# EAGLE design XuLA-LA (EAGLE 5.11)
AUTHOR: Dave Vandenbout / XESS Corp.; DIGIKEY#: 296-16843-1-ND; MANF: TDK; MANF#: C1608X7R1C105KT; MOUSER#: 810-C1608X7R1C105K; VERSION#: 1.0
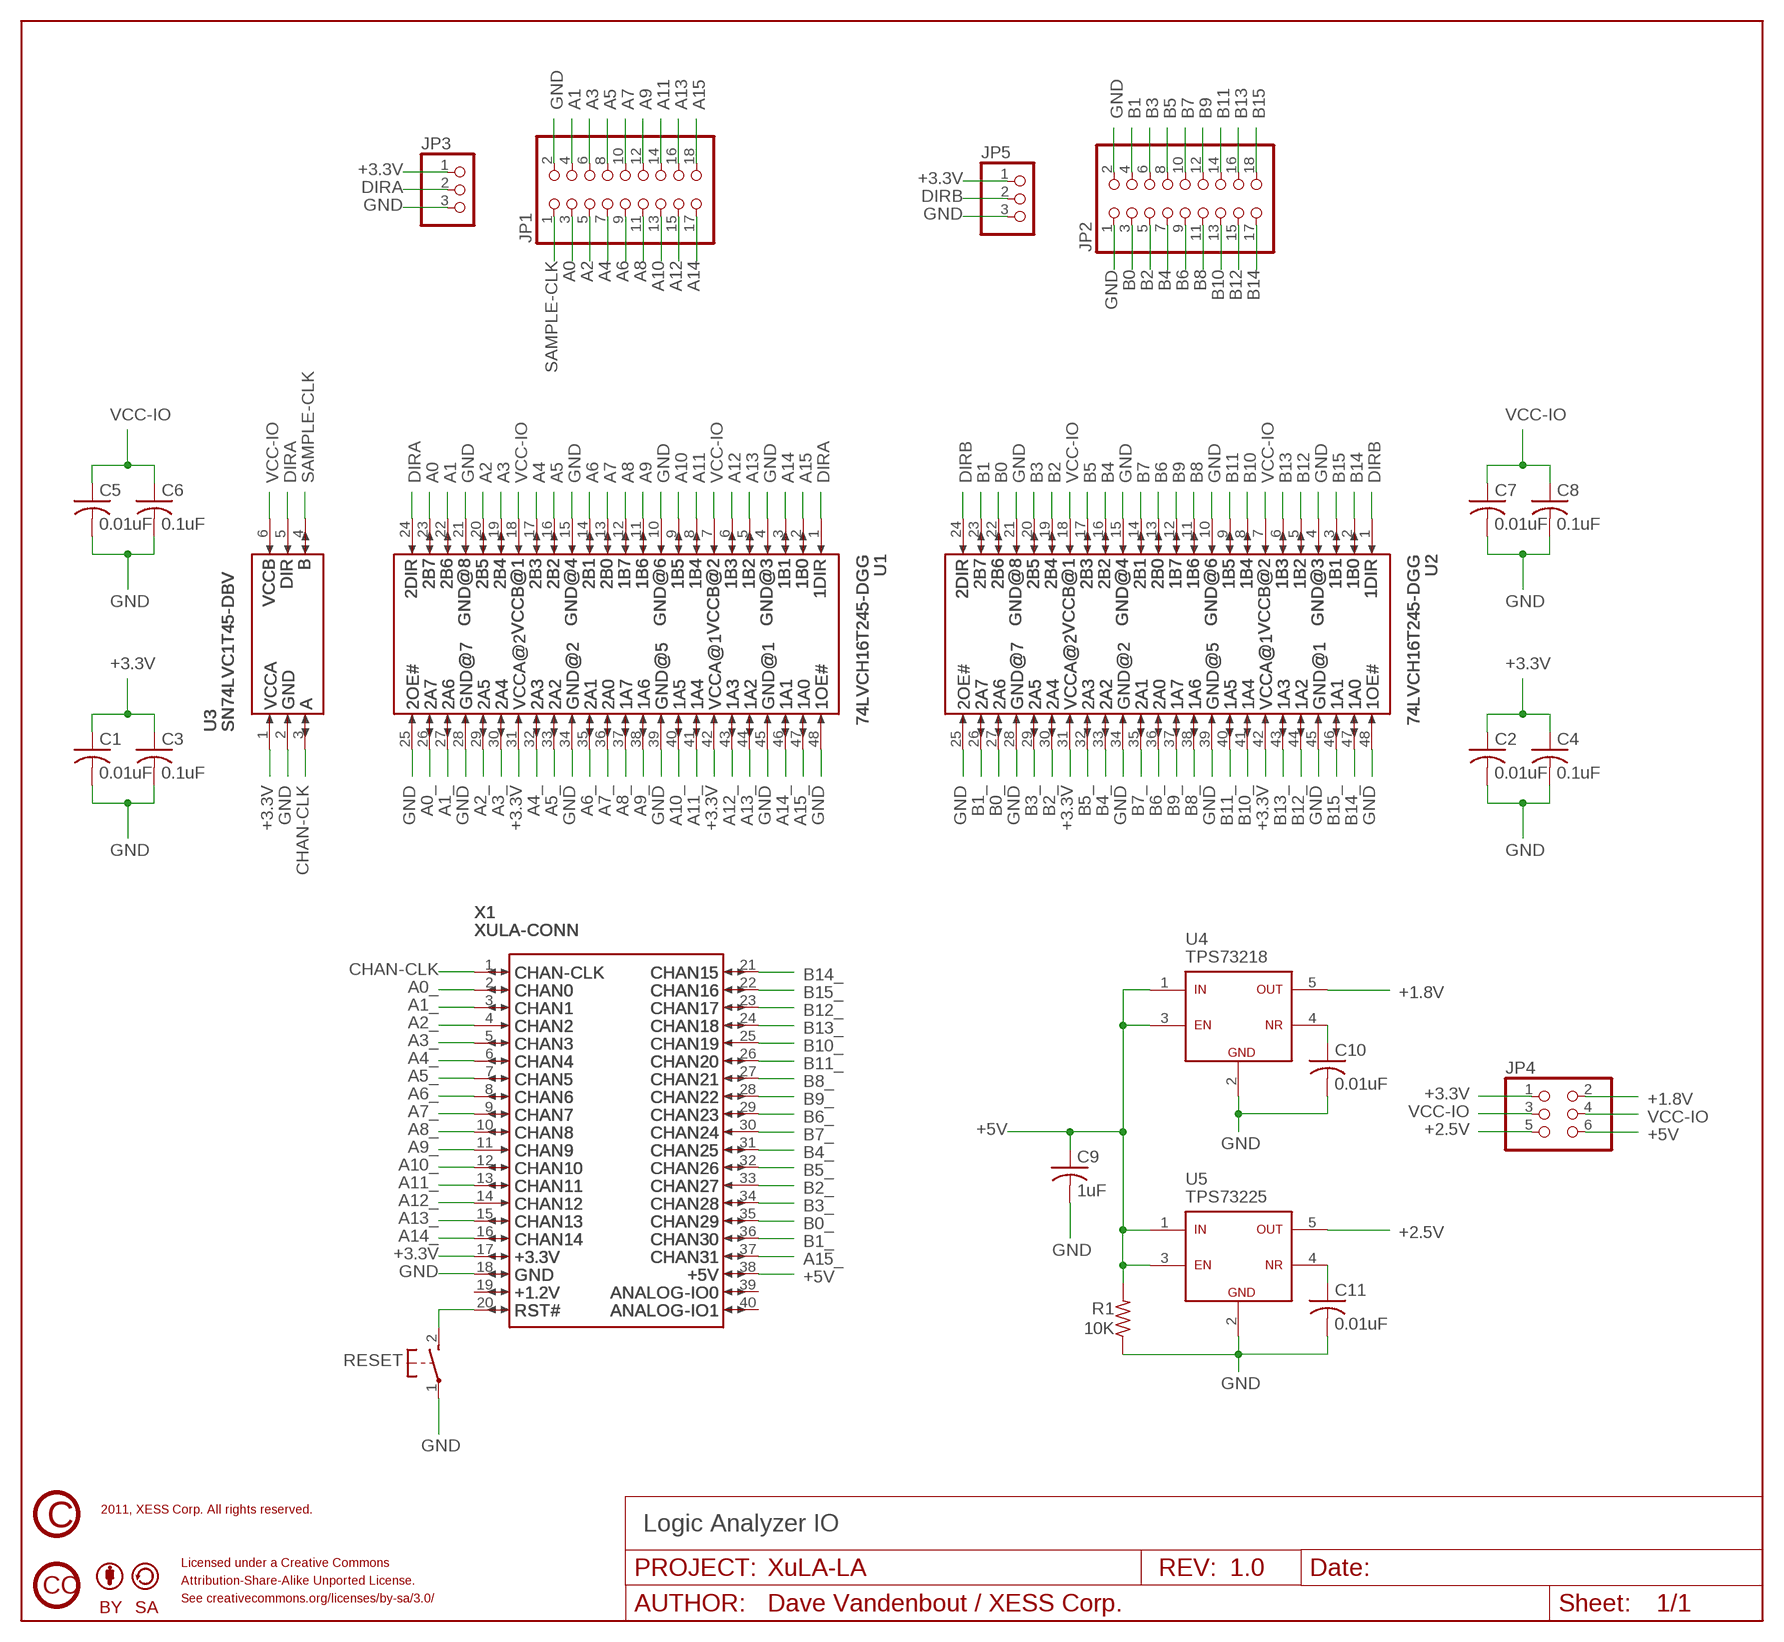
[diagram p0: schematic, sheet 1]

## Parts
C1  0.01uF  C-USC0402  [C0402]
C2  0.01uF  C-USC0402  [C0402]
C3  0.1uF  C-USC0603  [C0603]
C4  0.1uF  C-USC0603  [C0603]
C5  0.01uF  C-USC0402  [C0402]
C6  0.1uF  C-USC0603  [C0603]
C7  0.01uF  C-USC0402  [C0402]
C8  0.1uF  C-USC0603  [C0603]
C9  1uF  C-USC0603  [C0603]
C10  0.01uF  C-USC0603  [C0603]
C11  0.01uF  C-USC0603  [C0603]
JP1  PINHD-2X9  [2X09]
JP2  PINHD-2X9  [2X09]
JP3  PINHD-1X3  [1X03]
JP4  PINHD-2X3  [2X03]
JP5  PINHD-1X3  [1X03]
R1  10K  R-US_R0805  [R0805]
RESET  MINI_TACT_SW  [TL3310AF120QG]
U1  74LVCH16T245-DGG  [TI-TSSOP48]
U2  74LVCH16T245-DGG  [TI-TSSOP48]
U3  SN74LVC1T45-DBV  [TI-R-PDSO-G6-DBV]
U4  TPS73218  TPS732XX  [SOP5]
U5  TPS73225  TPS732XX  [SOP5]
U$2  CC_CC  [CC_CC]
U$3  CC_BY  [CC_BY]
U$4  CC_SA  [CC_SA]
U$5  CC_COPYRIGHT  [CC_COPYRIGHT]
X1  XULA-CONN  [XULA-DIP40]

## Nets
+1.8V: JP4.2 U4.5
+2.5V: JP4.5 U5.5
+3.3V: C1.1 C2.1 C3.1 C4.1 JP3.1 JP4.1 JP5.1 U1.31 U1.42 U2.31 U2.42 U3.1 X1.17
+5V: C9.1 JP4.6 R1.2 U4.1 U4.3 U5.1 U5.3 X1.38
A0: JP1.3 U1.23
A0_: U1.26 X1.2
A1: JP1.4 U1.22
A1_: U1.27 X1.3
A2: JP1.5 U1.20
A2_: U1.29 X1.4
A3: JP1.6 U1.19
A3_: U1.30 X1.5
A4: JP1.7 U1.17
A4_: U1.32 X1.6
A5: JP1.8 U1.16
A5_: U1.33 X1.7
A6: JP1.9 U1.14
A6_: U1.35 X1.8
A7: JP1.10 U1.13
A7_: U1.36 X1.9
A8: JP1.11 U1.12
A8_: U1.37 X1.10
A9: JP1.12 U1.11
A9_: U1.38 X1.11
A10: JP1.13 U1.9
A10_: U1.40 X1.12
A11: JP1.14 U1.8
A11_: U1.41 X1.13
A12: JP1.15 U1.6
A12_: U1.43 X1.14
A13: JP1.16 U1.5
A13_: U1.44 X1.15
A14: JP1.17 U1.3
A14_: U1.46 X1.16
A15: JP1.18 U1.2
A15_: U1.47 X1.37
B0: JP2.3 U2.22
B0_: U2.27 X1.35
B1: JP2.4 U2.23
B1_: U2.26 X1.36
B2: JP2.5 U2.19
B2_: U2.30 X1.33
B3: JP2.6 U2.20
B3_: U2.29 X1.34
B4: JP2.7 U2.16
B4_: U2.33 X1.31
B5: JP2.8 U2.17
B5_: U2.32 X1.32
B6: JP2.9 U2.13
B6_: U2.36 X1.29
B7: JP2.10 U2.14
B7_: U2.35 X1.30
B8: JP2.11 U2.11
B8_: U2.38 X1.27
B9: JP2.12 U2.12
B9_: U2.37 X1.28
B10: JP2.13 U2.8
B10_: U2.41 X1.25
B11: JP2.14 U2.9
B11_: U2.40 X1.26
B12: JP2.15 U2.5
B12_: U2.44 X1.23
B13: JP2.16 U2.6
B13_: U2.43 X1.24
B14: JP2.17 U2.2
B14_: U2.47 X1.21
B15: JP2.18 U2.3
B15_: U2.46 X1.22
CHAN-CLK: U3.3 X1.1
DIRA: JP3.2 U1.1 U1.24 U3.5
DIRB: JP5.2 U2.1 U2.24
GND: C1.2 C2.2 C3.2 C4.2 C5.2 C6.2 C7.2 C8.2 C9.2 C10.2 C11.2 JP1.2 JP2.1 JP2.2 JP3.3 JP5.3 R1.1 RESET.1(P) U1.4 U1.10 U1.15 U1.21 U1.25 U1.28 U1.34 U1.39 U1.45 U1.48 U2.4 U2.10 U2.15 U2.21 U2.25 U2.28 U2.34 U2.39 U2.45 U2.48 U3.2 U4.2 U5.2 X1.18
N$1: C10.1 U4.4
N$2: RESET.2(S) X1.20
N$4: C11.1 U5.4
SAMPLE-CLK: JP1.1 U3.4
VCC-IO: C5.1 C6.1 C7.1 C8.1 JP4.3 JP4.4 U1.7 U1.18 U2.7 U2.18 U3.6
Unconnected: X1.19 X1.39 X1.40

## Notes on the sheet
- 2011, XESS Corp. All rights reserved.
- Logic Analyzer IO
- Licensed under a Creative Commons
- Attribution-Share-Alike Unported License.
- See creativecommons.org/licenses/by-sa/3.0/

## Library data of the parts
C1-C11 = rcl:C-US: CAPACITOR, American symbol
JP1 JP2 = pinhead:PINHD-2X9: PIN HEADER
JP3 JP5 = pinhead:PINHD-1X3: PIN HEADER
JP4 = pinhead:PINHD-2X3: PIN HEADER
R1 = rcl:R-US_: RESISTOR, American symbol
RESET = xess:MINI_TACT_SW: Small SMD Tact Switch
U1 U2 = xess:74LVCH16T245: 16-Bit Dual-Supply Bus Transceiver with Configurable Voltage Translation and 3-State Outputs
U3 = xess:SN74LVC1T45: TI Single-Bit Dual-Supply Bus Transceiver with Configurable Voltage Translation and 3-State Outputs
U4 U5 = xess:TPS732XX: Linear Voltage Regulator
U$2 = xess:CC_CC
U$3 = xess:CC_BY
U$4 = xess:CC_SA
U$5 = xess:CC_COPYRIGHT
X1 = xess:XULA-CONN: XuLA Board Connector

## Net classes
1 power: clearance 0.254 mm

## Board
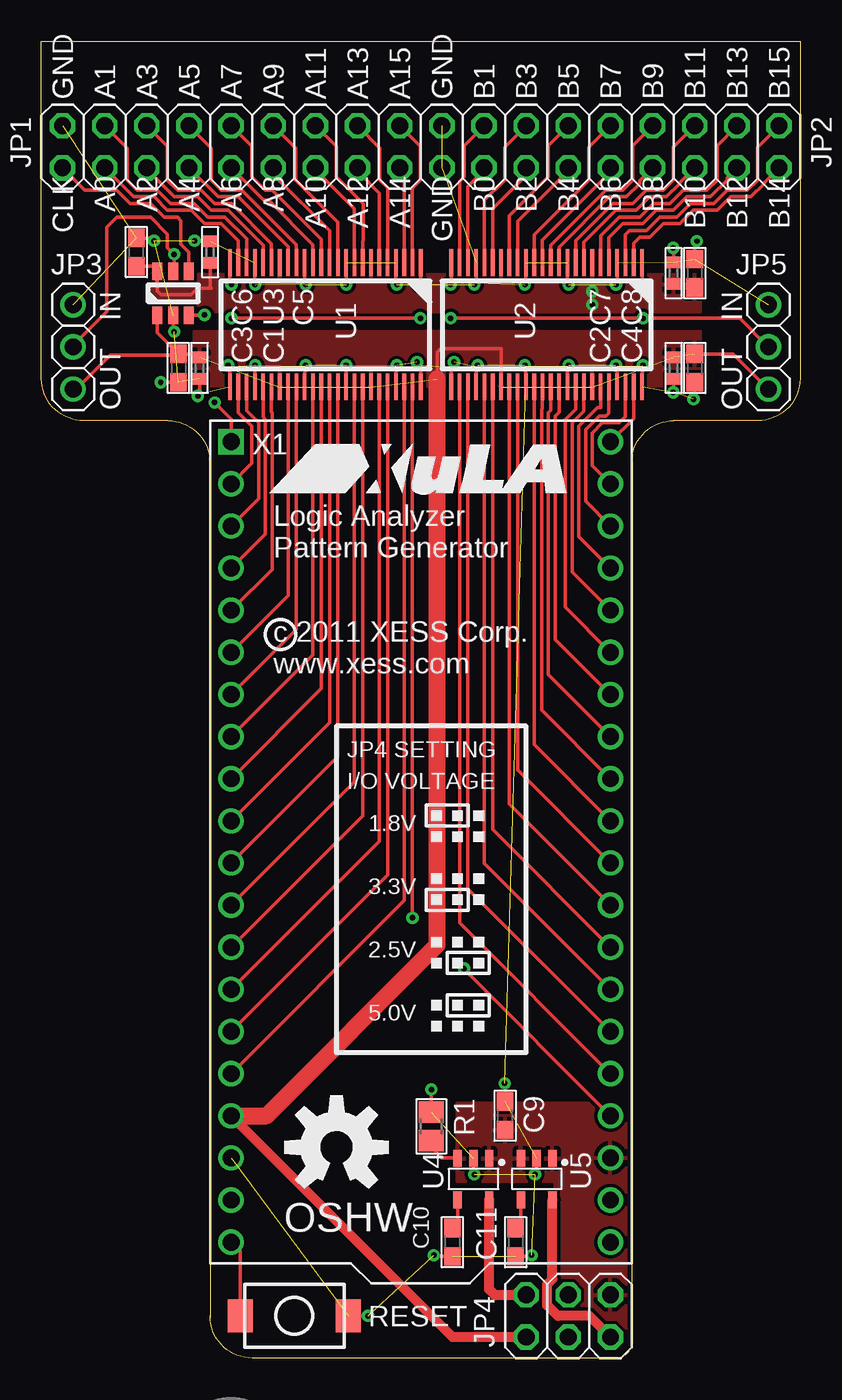
[diagram p1: board, top side]
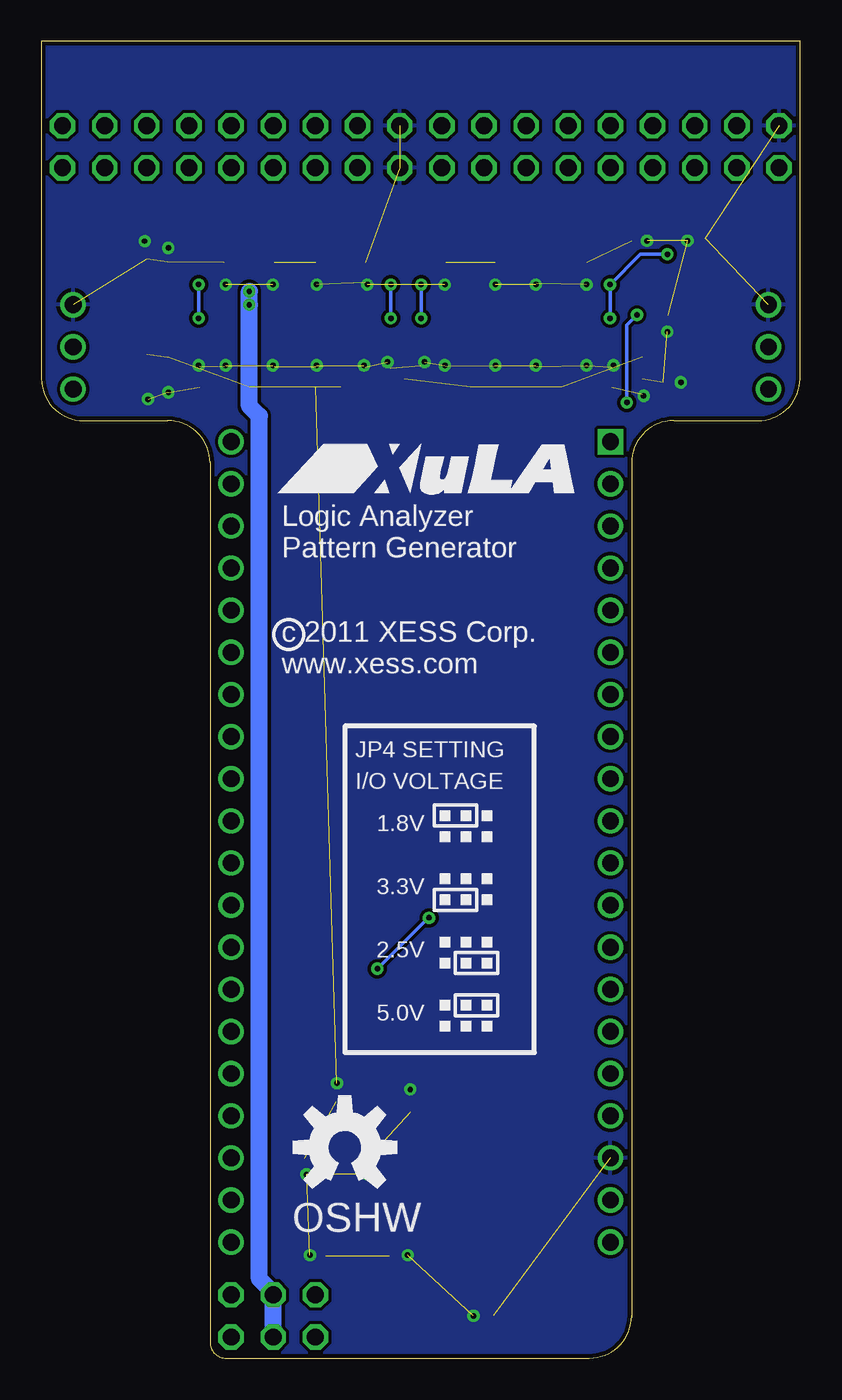
[diagram p2: board, bottom side, seen from below]

Size 45.72 x 79.38 mm. Coordinates in mm from the lower left corner, seen from the top.
Outline: 10.16,2.54 10.16,53.98 arc90 7.62,56.52 2.54,56.52 arc-90 0,59.05 0,79.38 45.72,79.38 45.72,59.05 arc-90 43.18,56.52 38.1,56.52 arc90 35.56,53.98 35.56,1.02 arc-90 34.67,0 12.7,0 arc-90 10.16,2.54
Outline: 10.16,2.54 10.16,2.44
Copper layers (1*16): Top 0.035mm / dielectric 1.5mm / Bottom 0.035mm
Design rules "ITeadstudio_safe": minimum track width 8mil, minimum drill 12mil, track to track 8mil, track to pad 8mil, pad to pad 8mil, via to via 8mil, smd to smd 0mil, copper to edge 10mil, drill to drill 10mil, minimum pad ring 10mil, minimum via ring 8mil, stop-mask expansion 2mil, vias tented up to drill 100mil, thermal gap 10mil

### Footprints (pad centres in the part's own frame; a part is rotated, then mirrored left to right if it is on the bottom)
C0402 = smd 0.7 x 0.9: 1 -0.65,0; 2 0.65,0
C0603 = smd 1.1 x 1: 1 -0.85,0; 2 0.85,0
2X09 = drill 1.016 octagon: 1 -10.16,-1.27; 2 -10.16,1.27; 3 -7.62,-1.27; 4 -7.62,1.27; 5 -5.08,-1.27; 6 -5.08,1.27; 7 -2.54,-1.27; 8 -2.54,1.27; 9 0,-1.27; 10 0,1.27; 11 2.54,-1.27; 12 2.54,1.27; 13 5.08,-1.27; 14 5.08,1.27; 15 7.62,-1.27; 16 7.62,1.27; 17 10.16,-1.27; 18 10.16,1.27
1X03 = drill 1.016 round: 1 -2.54,0; 2 0,0; 3 2.54,0
2X03 = drill 1.016 octagon: 1 -2.54,-1.27; 2 -2.54,1.27; 3 0,-1.27; 4 0,1.27; 5 2.54,-1.27; 6 2.54,1.27
R0805 = smd 1.3 x 1.5: 1 -0.85,0; 2 0.85,0
TL3310AF120QG = smd 1.5 x 2: 1 -3.25,0; 2 3.25,0
TI-TSSOP48 = smd 1.6 x 0.22: 1 0,0; 2 0,-0.5; 3 0,-1; 4 0,-1.5; 5 0,-2; 6 0,-2.5; 7 0,-3; 8 0,-3.5; 9 0,-4; 10 0,-4.5; 11 0,-5; 12 0,-5.5; 13 0,-6; 14 0,-6.5; 15 0,-7; 16 0,-7.5; 17 0,-8; 18 0,-8.5; 19 0,-9; 20 0,-9.5; 21 0,-10; 22 0,-10.5; 23 0,-11; 24 0,-11.5; 25 7.5,-11.5; 26 7.5,-11; 27 7.5,-10.5; 28 7.5,-10; 29 7.5,-9.5; 30 7.5,-9; 31 7.5,-8.5; 32 7.5,-8; 33 7.5,-7.5; 34 7.5,-7; 35 7.5,-6.5; 36 7.5,-6; 37 7.5,-5.5; 38 7.5,-5; 39 7.5,-4.5; 40 7.5,-4; 41 7.5,-3.5; 42 7.5,-3; 43 7.5,-2.5; 44 7.5,-2; 45 7.5,-1.5; 46 7.5,-1; 47 7.5,-0.5; 48 7.5,0
TI-R-PDSO-G6-DBV = smd 1.05 x 0.6: 1 0,0; 2 0,-0.95; 3 0,-1.9; 4 2.65,-1.9; 5 2.65,-0.95; 6 2.65,0
SOP5 = smd 1.016 x 0.508: 1 -1.25,0.95; 2 -1.25,0; 3 -1.25,-0.95; 4 1.25,-0.95; 5 1.25,0.95
XULA-DIP40 = drill 1.016 square: 1 49.53,24.13 | drill 1.016 round: 2 46.99,24.13; 3 44.45,24.13; 4 41.91,24.13; 5 39.37,24.13; 6 36.83,24.13; 7 34.29,24.13; 8 31.75,24.13; 9 29.21,24.13; 10 26.67,24.13; 11 24.13,24.13; 12 21.59,24.13; 13 19.05,24.13; 14 16.51,24.13; 15 13.97,24.13; 16 11.43,24.13; 17 8.89,24.13; 18 6.35,24.13; 19 3.81,24.13; 20 1.27,24.13; 21 49.53,1.27; 22 46.99,1.27; 23 44.45,1.27; 24 41.91,1.27; 25 39.37,1.27; 26 36.83,1.27; 27 34.29,1.27; 28 31.75,1.27; 29 29.21,1.27; 30 26.67,1.27; 31 24.13,1.27; 32 21.59,1.27; 33 19.05,1.27; 34 16.51,1.27; 35 13.97,1.27; 36 11.43,1.27; 37 8.89,1.27; 38 6.35,1.27; 39 3.81,1.27; 40 1.27,1.27

### Placement (x,y rotation side)
C1  9.53,59.69 270 top
C2  38.1,59.69 270 top
C3  8.26,59.69 270 top
C4  39.37,59.69 270 top
C5  10.16,66.67 90 top
C6  5.71,66.67 90 top
C7  38.1,65.41 90 top
C8  39.37,65.41 90 top
C9  27.94,14.61 90 top
C10  24.77,6.99 270 top
C11  28.57,6.99 270 top
JP1  11.43,73.03 0 top
JP2  34.29,73.03 0 top
JP3  1.91,60.96 90 top
JP4  31.75,2.54 0 top
JP5  43.81,60.96 90 top
R1  23.5,13.97 270 top
RESET  15.24,2.54 180 top
U1  22.86,66.04 270 top
U2  36.2,66.04 270 top
U3  6.99,62.87 90 top
U4  26.04,10.79 270 top
U5  29.84,10.79 270 top
U$2  11.43,-14.61 0 top  (outside the outline)
U$3  18.41,-13.34 0 top  (outside the outline)
U$4  23.5,-13.34 0 top  (outside the outline)
U$5  11.43,-5.71 0 top  (outside the outline)
X1  35.56,5.71 90 top

### Tracks (layer width: path | path; a pad name or v marks a point on that pad's centre or on a via)
+1.8V
  Top 0.61: U4.5 26.98,4.13 27.3,3.81 JP4.2
+2.5V
  Top 0.61: U5.5 30.8,4.76 30.48,4.45 30.48,3.17 31.11,2.54 33.02,2.54 JP4.5
+3.3V  (6 unrouted)
  Top 0.203: C4.1 41.7,60.54 JP5.1 | C3.1 9.32,60.54 C1.1 | U3.1 6.99,61.81 C3.1 | JP3.1 2.11,58.42 4.14,60.45 8.17,60.45 C3.1 | U2.31 27.7,60.84 27.71,60.86 24.05,60.86 23.85,60.66 23.85,59.03
  Top 0.61: X1.17 24.77,1.27 JP4.1
  Top 1.016: X1.17 13.56,14.61 23.85,24.89 23.85,59.03
  pour Top: 9.22,61.87 39.7,61.87 39.7,58.62 9.22,58.62
+5V
  Top 0.203: U5.1 30.82,12.06 | C9.1 27.94,13.34 | R1.2 23.5,12.7 24.13,12.06 25.07,12.06 U4.3
  pour Top: 25.07,15.34 25.07,10.67 30.96,10.67 30.96,1.32 36.45,1.32 36.45,15.34
A0
  Top 0.203: U1.23 11.86,67.36 10.85,68.38 9.83,68.38 9.02,69.19 7.59,69.19 6.78,70 5.56,70 JP1.3
A0_
  Top 0.203: U1.26 11.86,57 12.68,56.19 12.68,53.95 X1.2
A1
  Top 0.203: U1.22 12.36,67.47 11.05,68.78 10.03,68.78 9.22,69.6 7.8,69.6 6.99,70.41 5.77,70.41 5.16,71.02 5.16,72.95 JP1.4
A1_
  Top 0.203: U1.27 12.36,57.11 13.08,56.39 13.08,51.82 X1.3
A2
  Top 0.203: U1.20 13.36,67.08 11.25,69.19 10.24,69.19 9.42,70 8,70 6.78,71.22 6.78,71.32 JP1.5
A2_
  Top 0.203: U1.29 13.36,56.72 13.49,56.59 13.49,49.68 X1.4
A3
  Top 0.203: U1.19 13.86,67.19 11.46,69.6 10.44,69.6 9.63,70.41 8.2,70.41 7.59,71.02 7.59,73.05 JP1.6
A3_
  Top 0.203: U1.30 13.86,57.03 13.89,57 13.89,47.55 X1.5
A4
  Top 0.203: U1.17 14.86,67 11.86,70 10.64,70 JP1.7
A4_
  Top 0.203: U1.32 14.86,45.98 X1.6
A5
  Top 0.203: U1.16 15.36,67.11 12.06,70.41 10.85,70.41 10.24,71.02 10.24,72.95 JP1.8
A5_
  Top 0.203: U1.33 15.36,43.94 X1.7
A6
  Top 0.203: U1.14 16.36,67.13 13.69,69.8 13.39,69.8 JP1.9
A6_
  Top 0.203: U1.35 16.36,42.4 X1.8
A7
  Top 0.203: U1.13 16.86,67.44 13.89,70.41 13.49,70.41 12.68,71.22 12.68,73.05 JP1.10
A7_
  Top 0.203: U1.36 16.86,40.35 X1.9
A8
  Top 0.203: JP1.11 14.1,71.63 14.1,71.22 17.36,67.96 U1.12
A8_
  Top 0.203: U1.37 17.36,38.31 X1.10
A9
  Top 0.203: JP1.12 15.32,72.95 15.32,71.02 17.86,68.47 U1.11
A9_
  Top 0.203: U1.38 17.86,36.27 X1.11
A10
  Top 0.203: JP1.13 16.54,71.73 16.54,71.63 18.86,69.3 U1.9
A10_
  Top 0.203: U1.40 18.86,34.73 X1.12
A11
  Top 0.203: JP1.14 17.75,73.05 17.75,71.22 19.38,69.6 19.38,67.36 19.36,67.34 U1.8
A11_
  Top 0.203: U1.41 19.36,32.7 X1.13
A12
  Top 0.203: U1.6 20.36,70.24 19.18,71.42 19.18,71.63 JP1.15
A12_
  Top 0.203: U1.43 20.36,31.16 X1.14
A13
  Top 0.203: U1.5 20.86,70.56 20.4,71.02 20.4,72.95 JP1.16
A13_
  Top 0.203: U1.44 20.86,29.11 X1.15
A14
  Top 0.203: U1.3 21.86,71.48 JP1.17
A14_
  Top 0.203: U1.46 21.86,27.57 X1.16
A15
  Top 0.203: U1.2 22.36,70.54 22.84,71.02 22.84,73.05 JP1.18
A15_  (via drill 0.33)
  Top 0.203: v22.36,26.54 U1.47 | v25.48,23.47 25.48,23.42 X1.37
  Bottom 0.203: v22.36,26.54 22.41,26.54 v25.48,23.47
B0
  Top 0.203: U2.22 25.7,70.63 26.7,71.63 26.7,71.73 JP2.3
B0_
  Top 0.203: U2.27 25.7,28.28 X1.35
B1
  Top 0.203: U2.23 25.2,70.94 25.48,71.22 25.48,73.1 JP2.4
B1_
  Top 0.203: U2.26 25.2,26.24 X1.36
B2
  Top 0.203: U2.19 27.2,69.28 29.13,71.22 29.13,71.68 JP2.5
B2_
  Top 0.203: U2.30 27.2,31.86 X1.33
B3
  Top 0.203: U2.20 26.7,69.8 27.91,71.02 27.91,73 JP2.6
B3_
  Top 0.203: U2.29 26.7,29.82 X1.34
B4
  Top 0.203: U2.16 28.7,68.55 31.77,71.63 31.77,71.73 JP2.7
B4_
  Top 0.203: U2.33 28.7,35.44 X1.31
B5
  Top 0.203: U2.17 28.2,68.86 30.56,71.22 30.56,73.1 JP2.8
B5_
  Top 0.203: U2.32 28.2,33.4 X1.32
B6
  Top 0.203: U2.13 30.2,67.41 34.01,71.22 34.01,71.48 JP2.9
B6_
  Top 0.203: U2.36 30.2,57.25 30.15,57.2 30.15,39.06 X1.29
B7
  Top 0.203: U2.14 29.7,67.72 32.99,71.02 32.99,73 JP2.10
B7_
  Top 0.203: U2.35 29.7,36.98 X1.30
B8
  Top 0.203: U2.11 31.2,66.98 34.21,70 35.23,70 36.04,70.81 36.04,70.97 JP2.11
B8_
  Top 0.203: U2.38 31.2,57.03 30.96,56.79 30.96,43.33 X1.27
B9
  Top 0.203: U2.12 30.7,67.09 34.01,70.41 35.03,70.41 35.64,71.02 35.64,73.1 JP2.12
B9_
  Top 0.203: U2.37 30.7,57.14 30.56,57 30.56,41.2 X1.28
B10
  Top 0.203: U2.8 32.7,67.26 34.62,69.19 35.84,69.19 36.65,70 37.67,70 38.48,70.81 38.48,70.87 JP2.13
B10_
  Top 0.203: U2.41 32.7,57.1 31.98,56.39 31.98,47.4 X1.25
B11
  Top 0.203: U2.9 32.2,67.37 34.42,69.6 35.64,69.6 36.45,70.41 37.47,70.41 38.08,71.02 38.08,73 JP2.14
B11_
  Top 0.203: U2.40 32.2,57.21 31.57,56.59 31.57,45.26 X1.26
B12
  Top 0.203: U2.5 34.2,67.55 35.03,68.38 36.25,68.38 37.06,69.19 38.08,69.19 38.89,70 40.31,70 41.33,71.02 41.33,71.17 JP2.15
B12_
  Top 0.203: X1.23 32.79,51.66 32.79,55.98 33.6,56.79 34.01,56.79 34.2,56.98 U2.44
B13
  Top 0.203: U2.6 33.7,67.66 34.82,68.78 36.04,68.78 36.85,69.6 37.87,69.6 38.68,70.41 40.11,70.41 40.72,71.02 40.72,73.1 JP2.16
B13_
  Top 0.203: U2.43 33.7,57.29 33.49,57.29 32.38,56.19 32.38,49.53 X1.24
B14
  Top 0.203: U2.2 35.7,67.22 36.04,67.56 36.65,67.56 37.47,68.38 38.48,68.38 39.29,69.19 40.72,69.19 41.53,70 42.75,70 43.56,70.81 43.56,70.87 JP2.17
B14_
  Top 0.203: U2.47 35.7,56.65 X1.21
B15
  Top 0.203: U2.3 35.2,67.73 35.43,67.97 36.45,67.97 37.26,68.78 38.28,68.78 39.09,69.6 40.51,69.6 41.33,70.41 42.55,70.41 43.16,71.02 43.16,73 JP2.18
B15_
  Top 0.203: U2.46 35.2,56.76 34.82,56.39 33.81,56.39 33.2,55.78 33.2,53.8 X1.22
CHAN-CLK  (via drill 0.33)
  Top 0.203: X1.1 11.43,56.62 v10.44,57.61 | v9.83,62.89 8.91,62.89 U3.3
  Bottom 0.203: v10.44,57.61 10.44,62.28 v9.83,62.89
DIRA  (via drill 0.33)
  Top 0.203: U1.1 22.86,64.75 v22.84,64.72 | v11.46,62.69 v22.84,62.69 | U1.24 11.36,64.81 v11.46,64.72 | U3.5 8,65.58 v8,66.55 7.59,66.95 7.59,67.77 6.58,68.78 4.55,68.78 3.94,68.17 3.94,63.09 1.91,61.06 JP3.2
  Bottom 0.203: v22.84,62.69 v22.84,64.72 | v11.46,62.69 v11.46,64.72 9.63,66.55 v8,66.55
DIRB  (via drill 0.33)
  Top 0.203: U2.24 24.7,64.75 v24.66,64.72 | U2.1 36.2,64.77 v36.25,64.72 | v24.66,62.69 v36.25,62.69 42.09,62.69 JP5.2
  Bottom 0.203: v24.66,62.69 v24.66,64.72 | v36.25,62.69 v36.25,64.72
GND  (via drill 0.33)  (41 unrouted)
  Top 0.203: U1.25 11.36,59.73 v11.25,59.84 | U1.28 12.86,59.83 v12.88,59.84 | U1.34 15.86,59.78 v15.93,59.84 | U1.39 v18.36,59.84 | U1.45 21.36,59.79 v21.41,59.84 | U1.48 22.86,59.82 v22.63,60.05 | U2.48 36.2,59.79 v36.25,59.84 | U2.45 34.7,59.77 v34.62,59.84 | U2.39 31.7,59.76 v31.77,59.84 | U2.34 29.2,59.78 v29.13,59.84 | U2.28 26.2,59.75 v26.29,59.84 | U2.25 24.7,59.67 v24.87,60.05 | U1.21 12.86,64.74 v12.88,64.72 | U1.15 15.86,64.78 v15.93,64.72 | U1.10 v18.36,64.72 | U1.4 21.36,64.77 v21.41,64.72 | U2.21 26.2,64.83 v26.09,64.72 | U2.15 29.2,64.78 v29.13,64.72 | U2.10 31.7,64.8 v31.77,64.72 | U2.4 34.7,64.79 v34.62,64.72 | C7.2 38.1,66.9 v38.08,66.93 | C8.2 39.37,67.21 v39.5,67.33 | C2.2 38.1,58.24 v38.08,58.22 | C4.2 39.37,57.89 v39.29,57.81 | C5.2 9.46,67.33 v9.22,67.36 | C6.2 6.62,67.53 v6.78,67.36 | U3.2 7.93,61.94 v8,61.87 | C3.2 7.2,58.84 v7.19,58.83 | C1.2 9.53,58.12 v9.42,58.01 | C9.2 27.94,16.33 v27.91,16.56 | U5.2 29.84,11.18 v29.74,11.07 | U4.2 26.04,11.12 v26.09,11.07 | C10.2 23.71,6.13 v23.65,6.2 | C11.2 29.48,6.13 v29.54,6.2 | R1.1 v23.5,16.19 | RESET.1 v19.68,2.54
  pour Bottom: -1.91,81.92 -1.91,-3.17 47.62,-3.17 47.62,81.92
N$1
  Top 0.203: U4.4 25.09,8.15 C10.1
N$2
  Top 0.203: RESET.2 11.99,6.42 X1.20
N$4
  Top 0.203: U5.4 28.89,8.15 C11.1
SAMPLE-CLK
  Top 0.203: U3.4 8.88,66.68 8.41,67.16 8.41,68.58 8.2,68.78 7.39,68.78 6.58,69.6 5.36,69.6 4.55,70.41 2.62,70.41 JP1.1
VCC-IO  (via drill 0.33)
  Top 0.203: C5.1 10.16,64.59 10.24,64.52 9.42,64.52 9.02,64.11 7.19,64.11 6.99,64.31 U3.6 6.67,65.83 C6.1
  Bottom 1.016: JP4.3 JP4.4 31.75,3.94 32.59,4.78 32.59,56.79 33.2,57.4 v33.2,63.5 v33.2,64.31
  pour Top: 6.58,65.33 39.7,65.33 39.7,63.09 6.58,63.09

### Text on the board
tPlace: GND | A1 | A3 | A5 | A7 | A9 | A11 | A13 | A15 | GND | B1 | B3 | B5 | B7 | B9 | B11 | B13 | B15 | CLK | A0 | A2 | A4 | A6 | A8 | A10 | A12 | A14 | GND | B0 | B2 | B4 | B6 | B8 | B10 | B12 | B14 | IN | IN | OUT | OUT | Logic Analyzer | Pattern Generator | c 2011 XESS Corp. | www.xess.com | JP4 SETTING | I/O VOLTAGE | 1.8V | 3.3V | 2.5V | 5.0V | OSHW
bPlace: Logic Analyzer | Pattern Generator | c 2011 XESS Corp. | www.xess.com | JP4 SETTING | I/O VOLTAGE | 1.8V | 3.3V | 2.5V | 5.0V | OSHW
tDocu: 2011, XESS Corp. | Licensed under a Creative Commons | Attribution-Share-Alike Unported License. | See creativecommons.org/licenses/by-sa/3.0/
XULA2_PINS: CHAN-CLK | T7 | T4 | B14 | A0 | R7 | R2 | B15 | A1 | R15 | R1 | B12 | A2 | R16 | M2 | B13 | A3 | M15 | M1 | B10 | A4 | M16 | K3 | B11 | A5 | K15 | J4 | B8 | A6 | K16 | H1 | B9 | A7 | J16 | H2 | B6 | A8 | J14 | F1 | B7 | A9 | F15 | F2 | B4 | A10 | F16 | E1 | B5 | A11 | C16 | E2 | B2 | A12 | C15 | C1 | B3 | A13 | B16 | B1 | B0 | A14 | B15 | B2 | B1 | A2 | A15 | Logic Analyzer Channel | Logic Analyzer Channel | XuLA2 FPGA Pin | XuLA2 FPGA Pin